# EAGLE design Driver Screen Board (EAGLE 9.6.2)
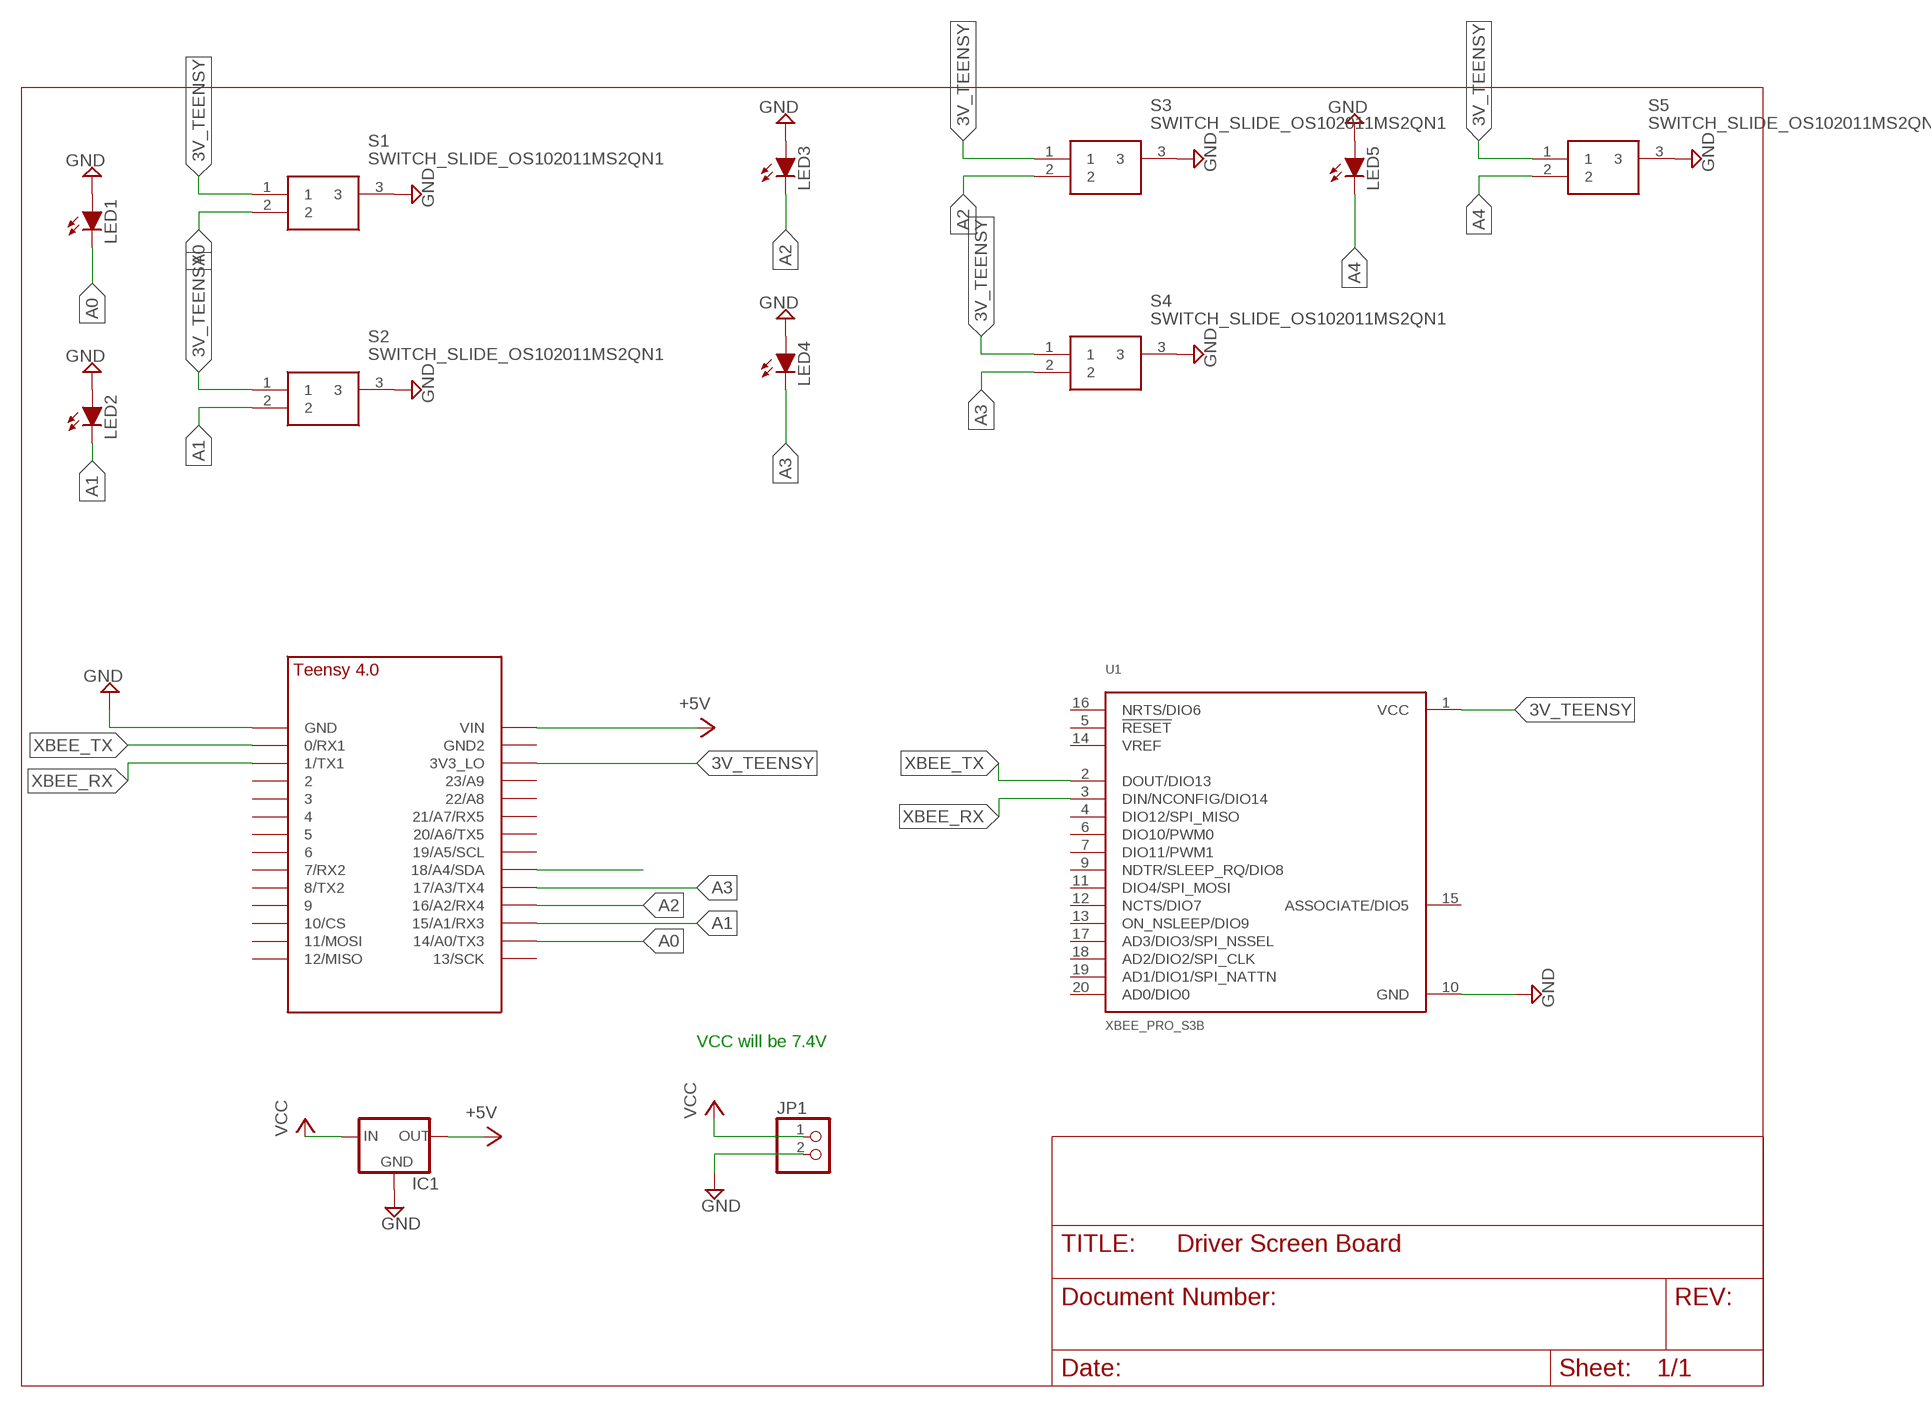
[diagram p0: schematic, sheet 1]

## Parts
IC1  REG_5V_L7805_HOR_HOLE  [TO-220-H-HOLE]
JP1  PINHD-1X2  [1X02]
LED1  LED-5MM  [LED-5MM]
LED2  LED-5MM  [LED-5MM]
LED3  LED-5MM  [LED-5MM]
LED4  LED-5MM  [LED-5MM]
LED5  LED-5MM  [LED-5MM]
S1  SWITCH_SLIDE_OS102011MS2QN1  [OS102011MA1QN1]
S2  SWITCH_SLIDE_OS102011MS2QN1  [OS102011MA1QN1]
S3  SWITCH_SLIDE_OS102011MS2QN1  [OS102011MA1QN1]
S4  SWITCH_SLIDE_OS102011MS2QN1  [OS102011MA1QN1]
S5  SWITCH_SLIDE_OS102011MS2QN1  [OS102011MA1QN1]
U1  XBEE_PRO_S3B  [XBEE_PRO_S3B]
U$1  TEENSY_4.0_SIMPLE  [TEENSY_4.0_SIMPLE]

## Nets
3V_TEENSY: S1.1 S2.1 S3.1 S4.1 S5.1 U1.1(VCC) U$1.3V3_LO
+5V: IC1.3(OUT) U$1.VIN
A0: LED1.K(C) S1.2 U$1.14/A0(14/A0/TX3)
A1: LED2.K(C) S2.2 U$1.15/A1(15/A1/RX3)
A2: LED3.K(C) S3.2 U$1.16/A2(16/A2/RX4)
A3: LED4.K(C) S4.2 U$1.17/A3(17/A3/TX4)
A4: LED5.K(C) S5.2 U$1.18/A4/SDA
GND: IC1.2(GND) JP1.2 LED1.A LED2.A LED3.A LED4.A LED5.A S1.3 S2.3 S3.3 S4.3 S5.3 U1.10(GND) U$1.GND
VCC: IC1.1(IN) JP1.1
XBEE_RX: U1.3(DIN/NCONFIG/DIO14) U$1.1/TX(1/TX1)
XBEE_TX: U1.2(DOUT/DIO13) U$1.0/RX(0/RX1)
Unconnected: U1.4(DIO12/SPI_MISO) U1.5(!RESET) U1.6(DIO10/PWM0) U1.7(DIO11/PWM1) U1.9(NDTR/SLEEP_RQ/DIO8) U1.11(DIO4/SPI_MOSI) U1.12(NCTS/DIO7) U1.13(ON_NSLEEP/DIO9) U1.14(VREF) U1.15(ASSOCIATE/DIO5) U1.16(NRTS/DIO6) U1.17(AD3/DIO3/SPI_NSSEL) U1.18(AD2/DIO2/SPI_CLK) U1.19(AD1/DIO1/SPI_NATTN) U1.20(AD0/DIO0) U$1.2 U$1.3/CANTX U$1.4/CANRX U$1.5 U$1.6 U$1.7(7/RX2) U$1.8(8/TX2) U$1.9/CS U$1.10/CS U$1.11/MOSI U$1.12/MISO U$1.13/SCK U$1.19/A5/SCL U$1.20/A6(20/A6/TX5) U$1.21/A7(21/A7/RX5) U$1.22/A8 U$1.23/A9 U$1.GND2

## Notes on the sheet
- VCC will be 7.4V

## Library data of the parts
IC1 = GTOR - Active Components:REG_5V_L7805: Voltage Regulator Switching 5v regulator Datasheet <http://power.murata.com/data/power/oki-78sr.pdf> Standard 7805 5V regulator. IGO (Input Ground Output). Spark Fun Electronics SKU : COM-00107 Datasheet <http://www.mouser.com/ds/2/308/MC7800-D-94905.pdf>
JP1 = GTOR - Connectors:PINHD-1X2: PIN HEADER
LED1-LED5 = GTOR - Passive Components:LED: Light Emitting Diode (LED) Source: Dangerous Prototypes Eagle Library <https://github.com/DangerousPrototypes/Eagle_Part_Library>
S1-S5 = GTOR - Active Components:SWITCH_SLIDE_OS102011MS2QN1: Switch Slide Miniature SPDT 0.1A 12VDC Through Hole Slide Switch SPDT On-On 0.1 A@ 12 V dc Slide Source: Datasheet <http://www.ckswitches.com/media/1428/os.pdf>; ARROW_PART_NUMBER: OS102011MS2QN1; ARROW_PRICE-STOCK: https://www.arrow.com/en/products/os102011ms2qn1/ck; DESCRIPTION: Switch Slide Miniature SPDT 0.1A 12VDC Through Hole Slide Switch SPDT On-On 0.1 A@ 12 V dc Slide; HEIGHT: mm; MANUFACTURER_NAME: C & K COMPONENTS; MANUFACTURER_PART_NUMBER: OS102011MS2QN1; MOUSER_PART_NUMBER: 611-OS102011MS2QN1; MOUSER_PRICE-STOCK: https://www.mouser.co.uk/ProductDetail/CK/OS102011MS2QN1?qs=WtljUlYws5RvQ1hEv876nQ%3D%3D
U1 = GTOR - Microcontroller:XBEE_PRO_S3B: XBee-PRO 900HP DigiMesh 900 MHz 200 Kbps RF Module with U.FL Connector; DESCRIPTION: General ISM < 1GHz Transceiver Module 900MHz Antenna Not Included, RP-SMA Through Hole; DIGI-KEY_PART_NUMBER: 602-1293-ND; MF: Digi International; MP: XBP9B-XCST-001; PACKAGE: Module Digi International
U$1 = GTOR - Microcontroller:TEENSY_4.0_SIMPLE

## Board
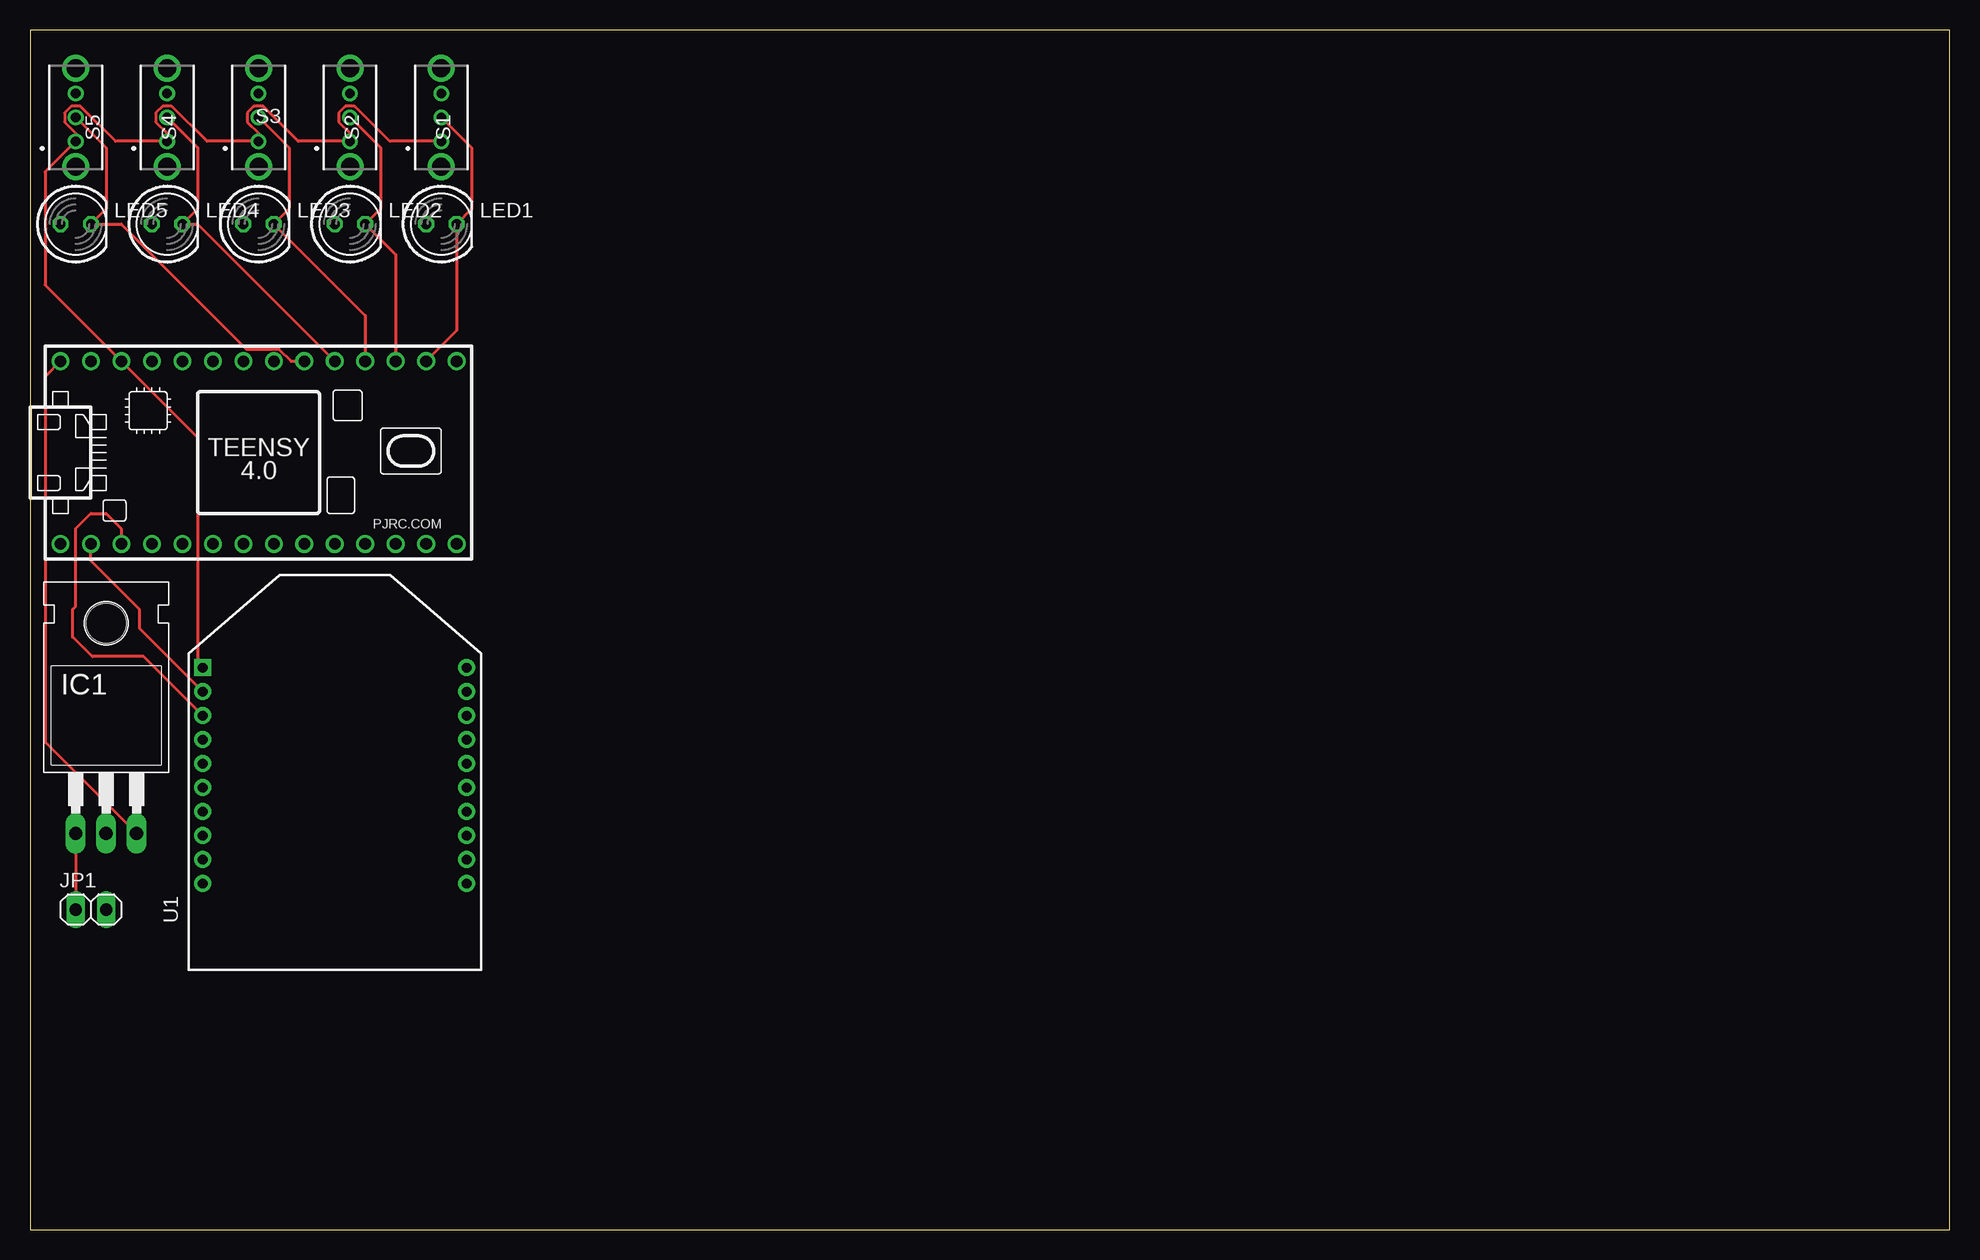
[diagram p1: board, top side]
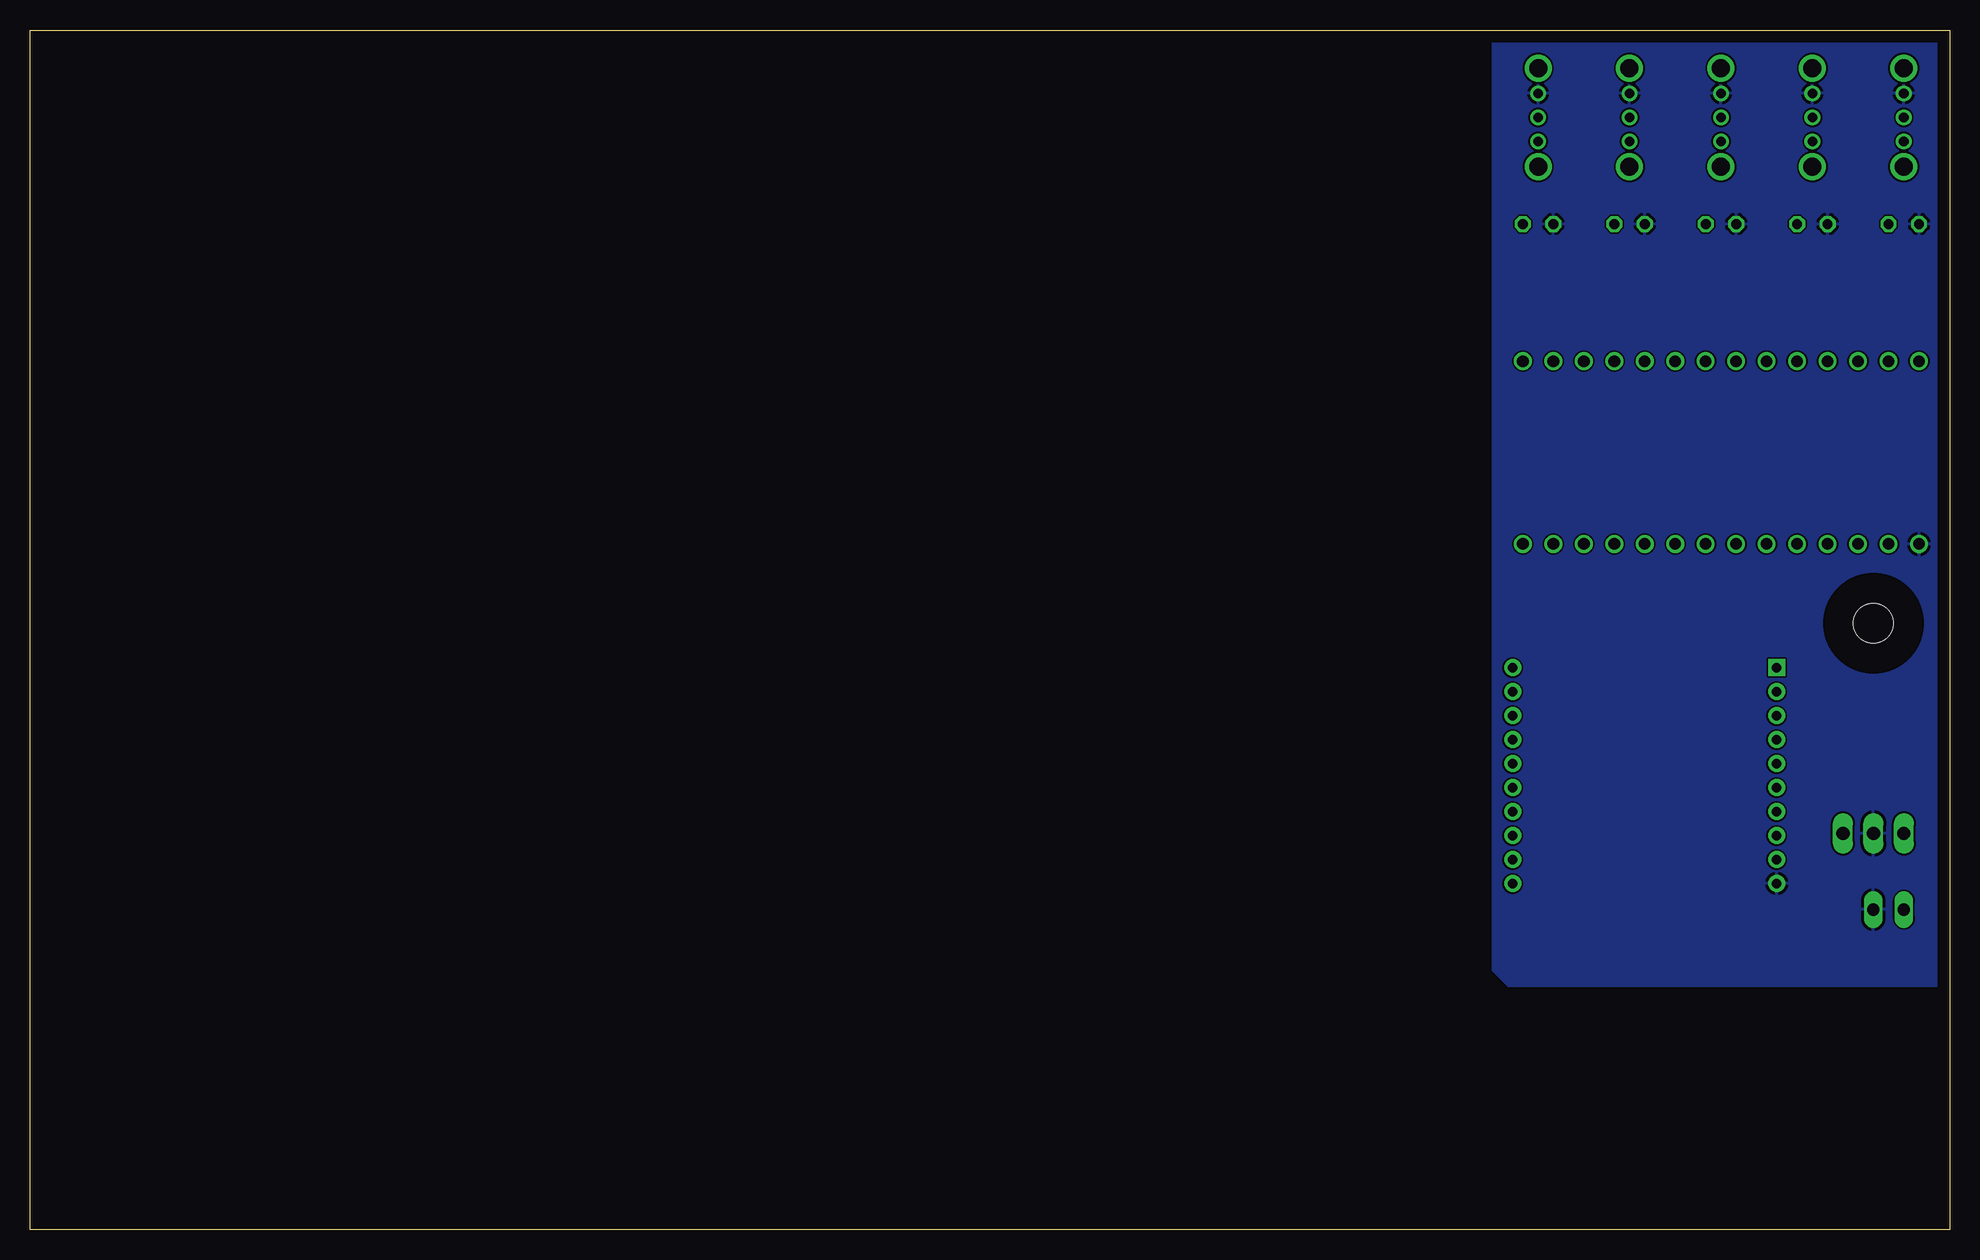
[diagram p2: board, bottom side, seen from below]

Size 160 x 100 mm. Coordinates in mm from the lower left corner, seen from the top.
Outline: 0,0 160,0 160,100 0,100 0,0
Copper layers (1*16): Top 0.035mm / dielectric 1.5mm / Bottom 0.035mm
Design rules "default": minimum track width 6mil, minimum drill 0.35mm, track to track 6mil, track to pad 6mil, pad to pad 6mil, via to via 6mil, smd to smd 6mil, copper to edge 40mil, drill to drill 6mil, minimum pad ring 10mil, minimum via ring 8mil, stop-mask expansion 4mil, vias tented up to drill 0mil, thermal gap 10mil

### Footprints (pad centres in the part's own frame; a part is rotated, then mirrored left to right if it is on the bottom)
TO-220-H-HOLE = drill 1.118 long: 1 -2.54,-6.35; 2 0,-6.35; 3 2.54,-6.35 | hole 3.302: 0,11.176
1X02 = drill 1.016 long: 1 -1.27,0; 2 1.27,0
LED-5MM = drill 0.813 octagon: A -1.27,0; K 1.27,0
OS102011MA1QN1 = drill 0.8 pad 1.3: 1 -2,0; 2 0,0; 3 2,0 | drill 1.5 pad 2.25: 4 -4.1,0; 5 4.1,0
XBEE_PRO_S3B = drill 0.8 pad 1.4 square: 1 -11,8.75 | drill 0.8 pad 1.4: 2 -11,6.75; 3 -11,4.75; 4 -11,2.75; 5 -11,0.75; 6 -11,-1.25; 7 -11,-3.25; 8 -11,-5.25; 9 -11,-7.25; 10 -11,-9.25; 11 11,-9.25; 12 11,-7.25; 13 11,-5.25; 14 11,-3.25; 15 11,-1.25; 16 11,0.75; 17 11,2.75; 18 11,4.75; 19 11,6.75; 20 11,8.75
TEENSY_4.0_SIMPLE = drill 0.965: 0/RX -13.97,-7.62; 1/TX -11.43,-7.62; 2 -8.89,-7.62; 3/CANTX -6.35,-7.62; 3V3_LO -11.43,7.62; 4/CANRX -3.81,-7.62; 5 -1.27,-7.62; 6 1.27,-7.62; 7 3.81,-7.62; 8 6.35,-7.62; 9/CS 8.89,-7.62; 10/CS 11.43,-7.62; 11/MOSI 13.97,-7.62; 12/MISO 16.51,-7.62; 13/SCK 16.51,7.62; 14/A0 13.97,7.62; 15/A1 11.43,7.62; 16/A2 8.89,7.62; 17/A3 6.35,7.62; 18/A4/SDA 3.81,7.62; 19/A5/SCL 1.27,7.62; 20/A6 -1.27,7.62; 21/A7 -3.81,7.62; 22/A8 -6.35,7.62; 23/A9 -8.89,7.62; GND -16.51,-7.62; GND2 -13.97,7.62; VIN -16.51,7.62

### Placement (x,y rotation side)
IC1  6.35,39.37 0 top
JP1  5.08,26.67 0 top
LED1  34.29,83.82 0 top
LED2  26.67,83.82 0 top
LED3  19.05,83.82 0 top
LED4  11.43,83.82 0 top
LED5  3.81,83.82 0 top
S1  34.29,92.71 90 top
S2  26.67,92.71 90 top
S3  19.05,92.71 90 top
S4  11.43,92.71 90 top
S5  3.81,92.71 90 top
U1  25.4,38.1 0 top
U$1  19.05,64.77 0 top

### Tracks (layer width: path | path; a pad name or v marks a point on that pad's centre or on a via)
3V_TEENSY
  Top 0.254: 26.13,90.71 S2.1 | 18.51,90.71 S3.1 | 10.89,90.71 S4.1 | U1.1 13.97,47.28 13.97,66.04 U$1.3V3_LO 1.27,78.74 1.27,88.17 S5.1 3.81,91.39 2.88,92.32 2.88,93.1 3.42,93.64 4.2,93.64 7.13,90.71 S4.1 | S1.1 29.99,90.71 27.06,93.64 26.28,93.64 25.74,93.1 25.74,92.32 26.67,91.39 S2.1 | S2.1 22.37,90.71 19.44,93.64 18.66,93.64 18.12,93.1 18.12,92.32 19.05,91.39 S3.1 | S3.1 14.75,90.71 11.82,93.64 11.04,93.64 10.5,93.1 10.5,92.32 11.43,91.39 S4.1
+5V
  Top 0.254: U$1.VIN 1.27,71.12 1.27,40.64 IC1.3
A0
  Top 0.254: S1.2 36.83,90.17 36.83,85.09 LED1.K 35.56,74.93 U$1.14/A0
A1
  Top 0.254: S2.2 29.21,90.17 29.21,85.09 LED2.K 30.48,81.28 U$1.15/A1
A2
  Top 0.254: S3.2 21.59,90.17 21.59,85.09 LED3.K 27.94,76.2 U$1.16/A2
A3
  Top 0.254: S4.2 13.97,90.17 13.97,85.09 LED4.K 13.97,83.82 U$1.17/A3
A4
  Top 0.254: U$1.18/A4/SDA 21.76,72.39 20.74,73.41 18.03,73.41 7.62,83.82 LED5.K 6.35,85.09 6.35,90.17 S5.2
GND
  pour Bottom: 0,100.33 36.83,100.33 38.1,99.06 38.1,21.59 36.83,20.32 0,20.32
VCC
  Top 0.254: IC1.1 JP1.1
XBEE_RX
  Top 0.254: U1.3 9.5,47.75 5.19,47.75 3.56,49.39 3.56,51.7 3.81,51.96 3.81,58.42 5.08,59.69 6.35,59.69 7.62,58.42 U$1.1/TX
XBEE_TX
  Top 0.254: U1.2 9.14,50.11 9.14,51.7 5.08,55.77 U$1.0/RX